# Altium schematic sheet NRF51822.SchDoc
size A
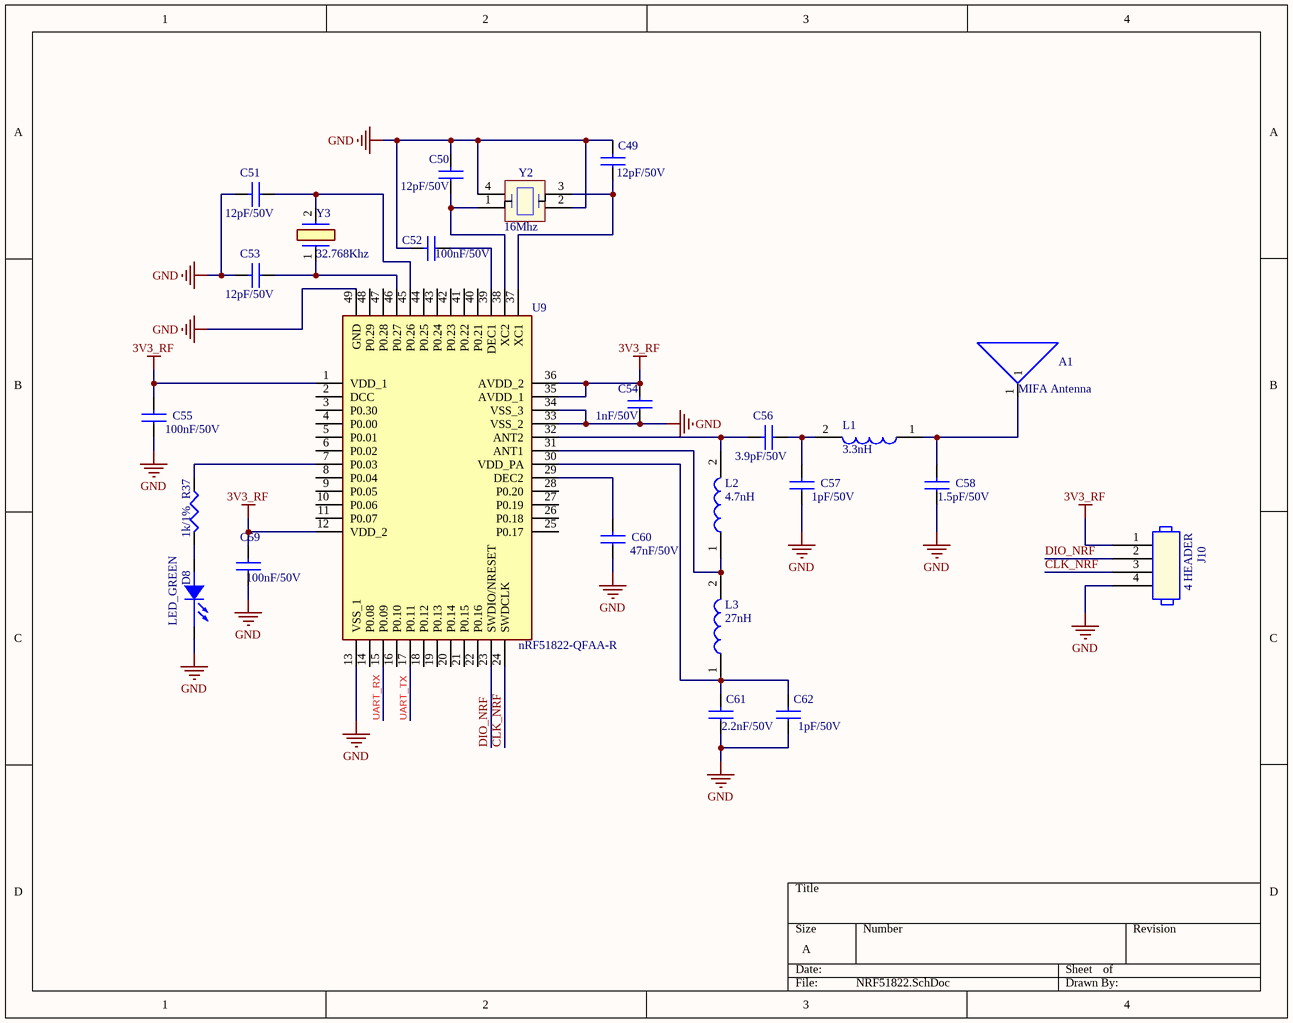
[diagram p0: NRF51822.SchDoc]

## Parts
A1  MIFA Antenna  [ANT-2.4GHZ-8.0X1.0MM]  (no BOM)
C49  12pF/50V  [C0402]
C50  12pF/50V  [C0402]
C51  12pF/50V  [C0402]
C52  100nF/50V  [C0402]
C53  12pF/50V  [C0402]
C54  1nF/50V  [C0402]
C55  100nF/50V  [C0402]
C56  3.9pF/50V  [C0402]
C57  1pF/50V  [C0402]
C58  1.5pF/50V  [C0402]
C59  100nF/50V  [C0402]
C60  47nF/50V  [C0402]
C61  2.2nF/50V  [C0402]
C62  1pF/50V  [C0402]
D8  LED_GREEN  [LED0603]
J10  4 HEADER  [ISP-4P-2_54]
L1  3.3nH  [LQG15WH0N7B02D]
L2  4.7nH  [LQG15WH0N7B02D]
L3  27nH  [LQG15WH0N7B02D]
R37  1k/1%  [R0402]
U9  nRF51822-QFAA-R  [QFN40P600X600X95-49N-D]
Y2  16Mhz  [Q22FA12800400]
Y3  32.768Khz  [ABS0532768KHZ9T]

## Nets
3V3_RF: C54.2 C55.2 C59.2 J10.1 U9.1(VDD_1) U9.12(VDD_2) U9.35(AVDD_1) U9.36(AVDD_2)
GND: C49.2 C50.2 C51.2 C52.2 C53.2 C54.1 C55.1 C57.1 C58.1 C59.1 C60.1 C61.1 C62.1 D8.1(CATHODE) J10.4 U9.13(VSS_1) U9.33(VSS_2) U9.34(VSS_3) U9.49(GND) Y2.2(GND_1) Y2.4(GND_2)
CLK_NRF: J10.3 U9.24(SWDCLK)
DIO_NRF: J10.2 U9.23(SWDIO/NRESET)
UART_RX: U9.15(P0.09)
UART_TX: U9.17(P0.11)
NetA1_1: A1.1 C58.2 L1.1
NetC49_1: C49.1 U9.37(XC1) Y2.3(CRYSTAL_2)
NetC50_1: C50.1 U9.38(XC2) Y2.1(CRYSTAL_1)
NetC51_1: C51.1 U9.45(P0.26) Y3.2
NetC52_1: C52.1 U9.39(DEC1)
NetC53_1: C53.1 U9.46(P0.27) Y3.1
NetC56_1: C56.1 C57.2 L1.2
NetC56_2: C56.2 L2.2 U9.32(ANT2)
NetC60_2: C60.2 U9.29(DEC2)
NetC61_2: C61.2 C62.2 L3.1 U9.30(VDD_PA)
NetD8_2: D8.2(ANODE) R37.1
NetL2_1: L2.1 L3.2 U9.31(ANT1)
NetR37_2: R37.2 U9.7(P0.03)

Not connected (* = marked no-connect by the designer): U9 2(DCC) 3(P0.30) 4(P0.00) 5(P0.01) 6(P0.02) 8(P0.04) 9(P0.05) 10(P0.06) 11(P0.07) 14(P0.08) 16(P0.10) 18(P0.12) 19(P0.13) 20(P0.14) 21(P0.15) 22(P0.16) 25(P0.17) 26(P0.18) 27(P0.19) 28(P0.20) 40(P0.21) 41(P0.22) 42(P0.23) 43(P0.24) 44(P0.25) 47(P0.28) 48(P0.29)

## Library data of the parts
A1 = Ceramic _ANTENNA: None; AMBIQ PN: PCB_ANTENNA
C49-C62 = CAP NP: PCB Footprint: C0402
D8 = LED: PCB Footprint: LED0603
L1-L3 = LQG15HS4N7C02D: Inductor; Manufacturer_Name: Murata Electronics; Datasheet Link: https://search.murata.co.jp/Ceramy/image/img/P02/JELF243B-0010.pdf; Height: 0.6mm; Manufacturer_Part_Number: LQG15HS4N7C02D; Mouser Part Number: 81-LQG15HS4N7C02D; Mouser Price/Stock: https://www.mouser.co.uk/ProductDetail/Murata-Electronics/LQG15HS4N7C02D?qs=60uY6ySkanQsgm4t8ngjFA%3D%3D; Arrow Part Number: LQG15HS4N7C02D; Arrow Price/Stock: https://www.arrow.com/en/products/lqg15hs4n7c02d/murata-manufacturing
R37 = RESISTOR: PCB Footprint: R0402
U9 = nRF51822-QFAA-R: Integrated Circuit; Manufacturer_Name: Nordic Semiconductor; Datasheet Link: https://datasheet.datasheetarchive.com/originals/distributors/Datasheets-DGA5/435665.pdf; Height: 0.95mm; Manufacturer_Part_Number: nRF51822-QFAA-R; Mouser Part Number: 949-NRF51822-QFAA-R; Mouser Price/Stock: https://www.mouser.co.uk/ProductDetail/Nordic-Semiconductor/nRF51822-QFAA-R?qs=7xCC5jQa1OJP%2FZdtChopZw%3D%3D; Arrow Part Number: NRF51822-QFAA-R; Arrow Price/Stock: https://www.arrow.com/en/products/nrf51822-qfaa-r/nordic-semiconductor?utm_currency=USD&region=nac
Y2 = Q22FA12800400: Crystal or Oscillator; Manufacturer_Name: Seiko Epson Corporation; Datasheet Link: https://datasheet.lcsc.com/szlcsc/Seiko-Epson-Q22FA12800400_C255875.pdf; Height: 0.5mm; Manufacturer_Part_Number: Q22FA12800400
Y3 = ABS05-32.768KHZ-9-T: Crystal or Oscillator; Manufacturer_Name: ABRACON; Datasheet Link: https://abracon.com/Resonators/ABS05.pdf; Height: 0.5mm; Manufacturer_Part_Number: ABS05-32.768KHZ-9-T; Mouser Part Number: 815-ABS05-32.768K9T; Mouser Price/Stock: https://www.mouser.co.uk/ProductDetail/ABRACON/ABS05-32.768KHZ-9-T?qs=Pyu0ZBy%2FIJbsNYnIET1z3A%3D%3D; Arrow Part Number: ABS05-32.768KHZ-9-T; Arrow Price/Stock: https://www.arrow.com/en/products/abs05-32.768khz-9-t/abracon?region=nac
J10 = 4 HEADER: PCB Footprint: ISP-4P-2_54